# Altium schematic sheet RP2040_MCU.SchDoc: RP2040 CNC
size B; Author: AM; CompanyName: Expatria Technologies; DrawnBy: A.Marles; Engineer: AM; Organization: Expatria Technolgoies; Address1: Schematic; DocumentNumber: 3; SheetNumber: 3; SheetTotal: 4
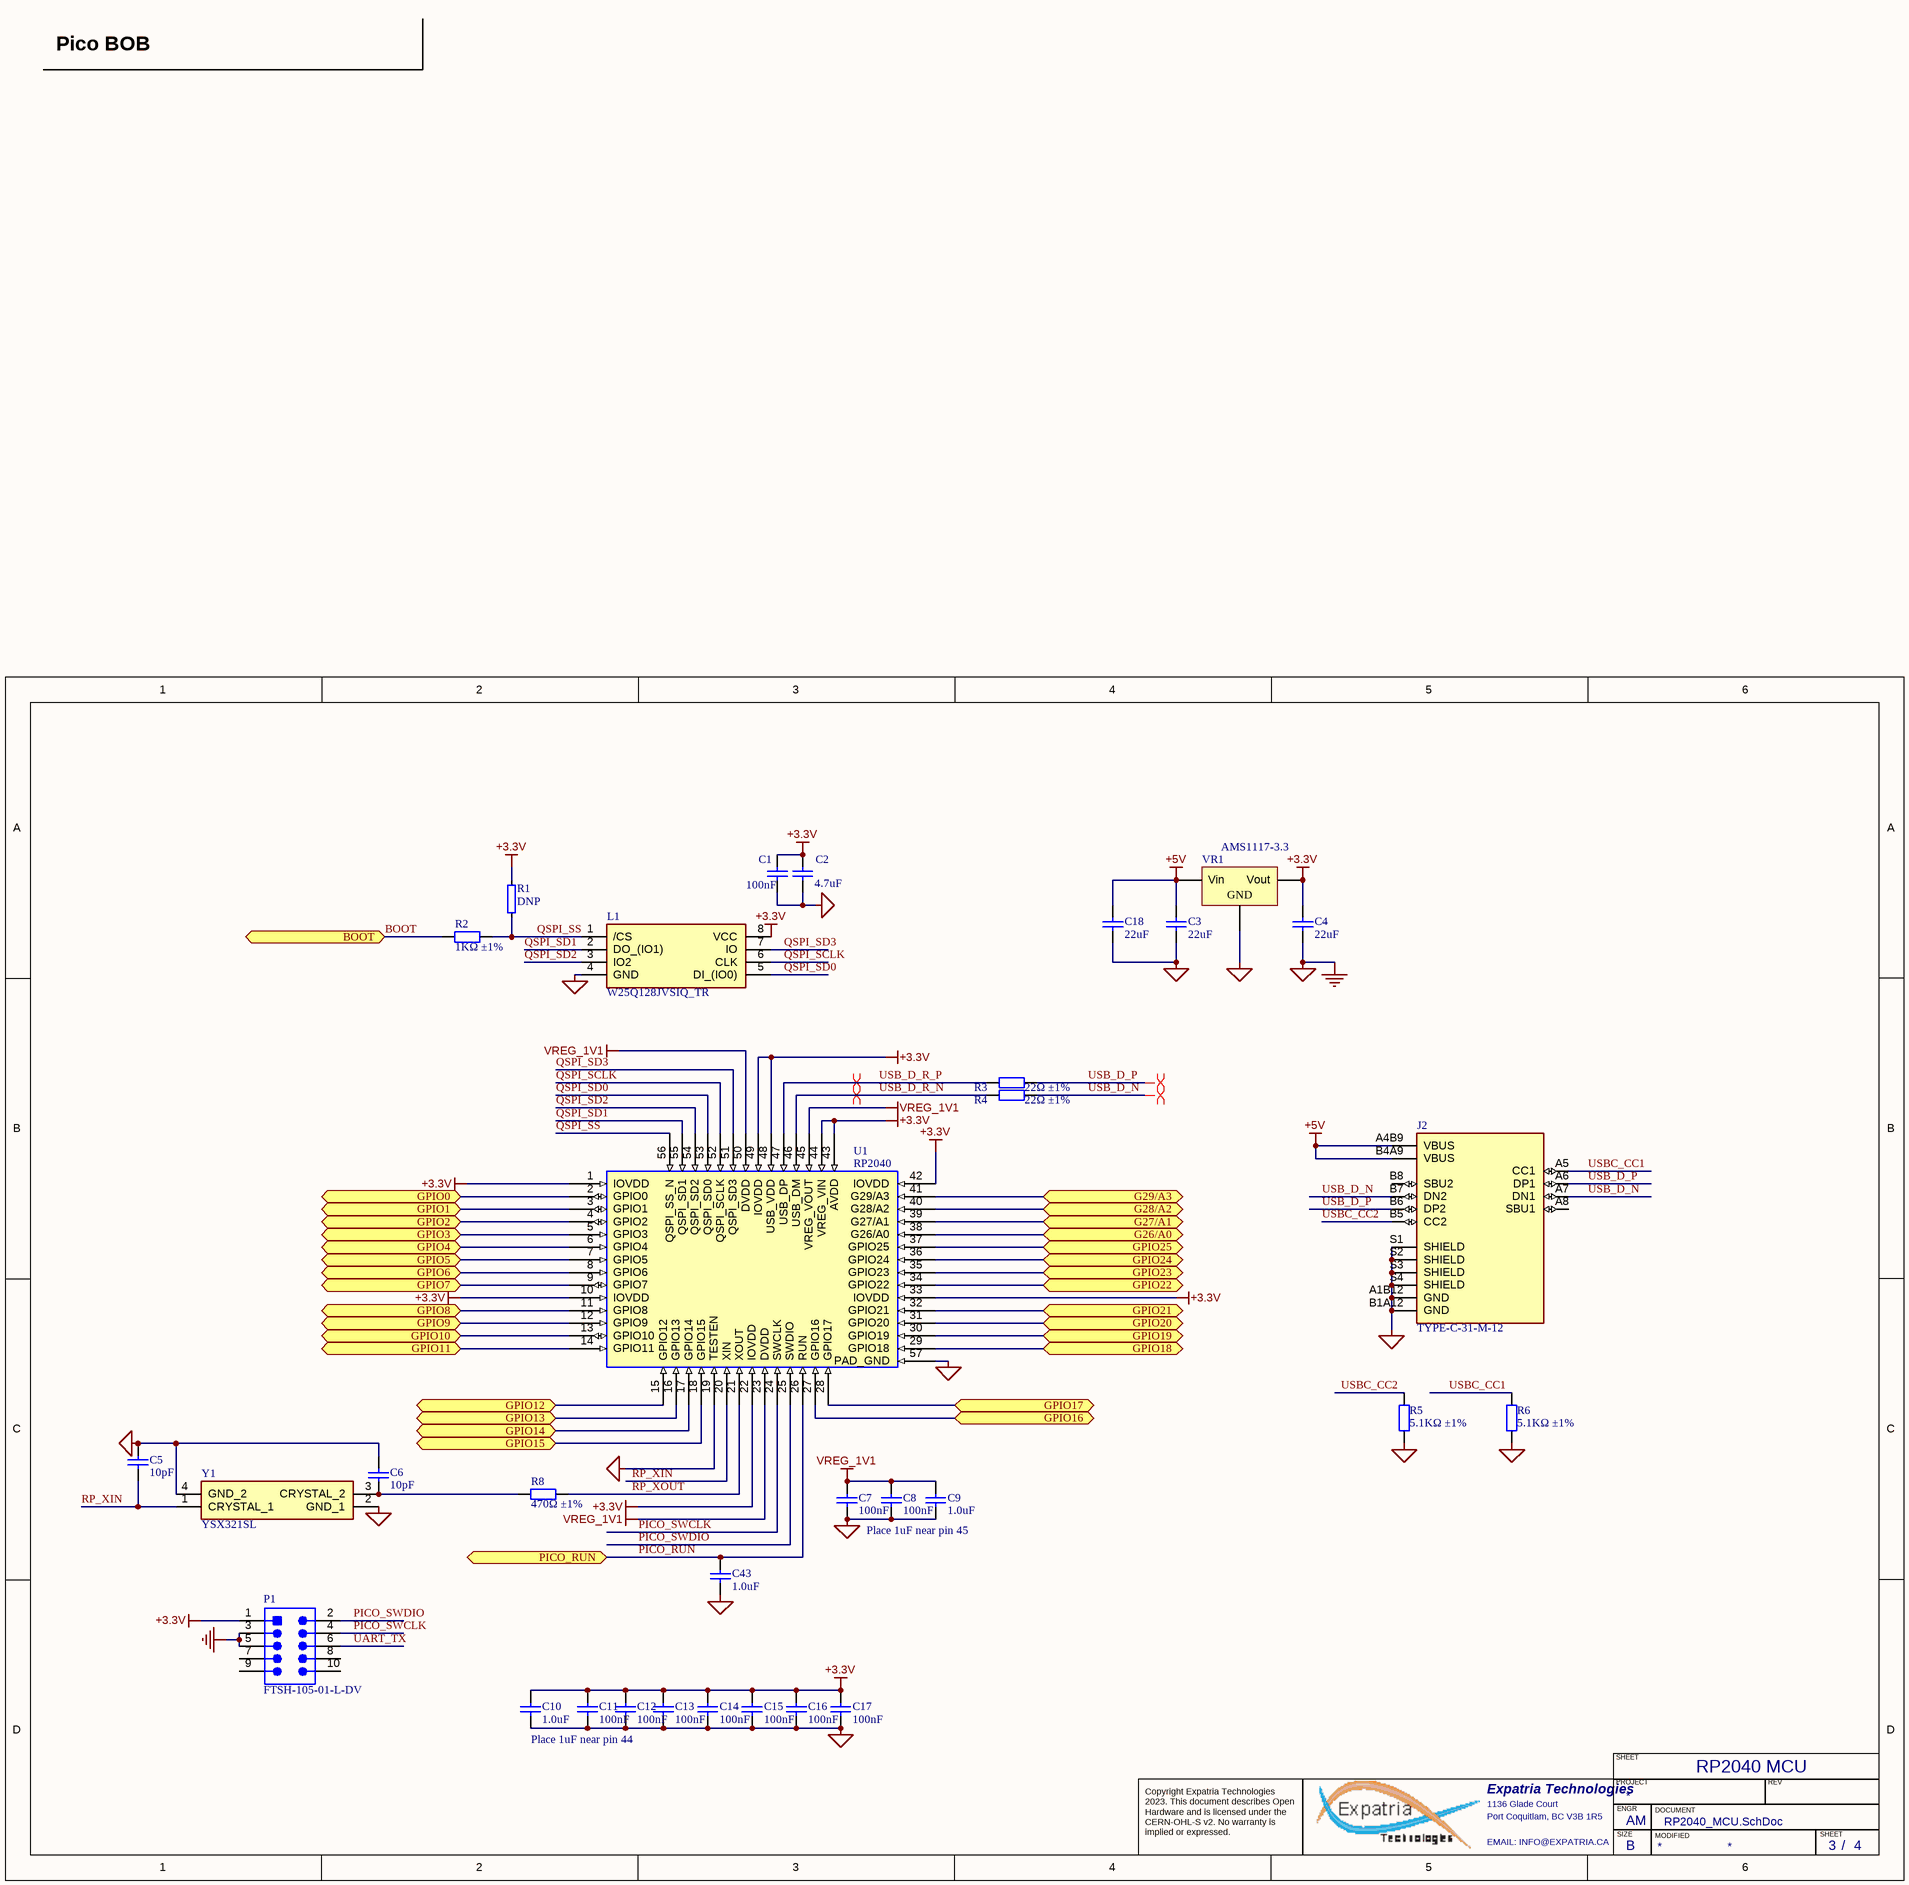
[diagram p0: RP2040_MCU.SchDoc]

## Parts
C1  100nF  [0402_C]
C2  4.7uF  [0402_C]
C3  22uF  [0805_C]
C4  22uF  [0805_C]
C5  10pF  [0402_C]
C6  10pF  [0402_C]
C7  100nF  [0402_C]
C8  100nF  [0402_C]
C9  1.0uF  [0402_C]
C10  1.0uF  [0402_C]
C11  100nF  [0402_C]
C12  100nF  [0402_C]
C13  100nF  [0402_C]
C14  100nF  [0402_C]
C15  100nF  [0402_C]
C16  100nF  [0402_C]
C17  100nF  [0402_C]
C18  22uF  [0805_C]
C43  1.0uF  [0402_C]
J2  TYPE-C-31-M-12  [HRO_TYPE-C-31-M-12]
L1  W25Q128JVSIQ_TR  [SOIC127P780X195-8N]
P1  FTSH-105-01-L-DV  [SMTC-FTSH-105-01-L-DV_V]  (no BOM)
R1  DNP  [0402]
R2  1KΩ ±1%  [0402_R]
R3  22Ω ±1%  [0402_R]
R4  22Ω ±1%  [0402_R]
R5  5.1KΩ ±1%  [0402_R]
R6  5.1KΩ ±1%  [0402_R]
R8  470Ω ±1%  [0402_R]
U1  RP2040  [RP2040]
VR1  AMS1117-3.3  [SOT-223]
Y1  YSX321SL  [YSX321SL]

## Ports
BOOT (bidir), G26/A0 (bidir), G27/A1 (bidir), G28/A2 (bidir), G29/A3 (bidir), GPIO0 (bidir), GPIO1 (bidir), GPIO2 (bidir), GPIO3 (bidir), GPIO4 (bidir), GPIO5 (bidir), GPIO6 (bidir), GPIO7 (bidir), GPIO8 (bidir), GPIO9 (bidir), GPIO10 (bidir), GPIO11 (bidir), GPIO12 (bidir), GPIO13 (bidir), GPIO14 (bidir), GPIO15 (bidir), GPIO16 (bidir), GPIO17 (bidir), GPIO18 (bidir), GPIO19 (bidir), GPIO20 (bidir), GPIO21 (bidir), GPIO22 (bidir), GPIO23 (bidir), GPIO24 (bidir), GPIO25 (bidir), PICO_RUN (bidir)

## Nets
+3.3V: C1.2 C2.2 C4.2 C10.2 C11.2 C12.2 C13.2 C14.2 C15.2 C16.2 C17.2 L1.8(VCC) P1.1 R1.2 U1.1(IOVDD) U1.10(IOVDD) U1.22(IOVDD) U1.33(IOVDD) U1.42(IOVDD) U1.43(AVDD) U1.44(VREG_VIN) U1.48(USB_VDD) U1.49(IOVDD) VR1.2(Vout)
+5V: C3.2 C18.2 J2.A4B9(VBUS) J2.B4A9(VBUS) VR1.3(Vin)
GND: C1.1 C2.1 C3.1 C4.1 C5.2 C6.2 C7.1 C8.1 C9.1 C10.1 C11.1 C12.1 C13.1 C14.1 C15.1 C16.1 C17.1 C18.1 C43.1 J2.A1B12(GND) J2.B1A12(GND) J2.S1(SHIELD) J2.S2(SHIELD) J2.S3(SHIELD) J2.S4(SHIELD) L1.4(GND) P1.3 P1.5 R5.2 R6.2 U1.19(TESTEN) U1.57(PAD_GND) VR1.1(GND) Y1.2(GND_1) Y1.4(GND_2)  [also labelled MCU_GND]
VREG_1V1: C7.2 C8.2 C9.2 U1.23(DVDD) U1.45(VREG_VOUT) U1.50(DVDD)
BOOT: R2.1 ; port BOOT
G26/A0: U1.38(G26/A0) ; port G26/A0
G27/A1: U1.39(G27/A1) ; port G27/A1
G28/A2: U1.40(G28/A2) ; port G28/A2
G29/A3: U1.41(G29/A3) ; port G29/A3
GPIO0: U1.2(GPIO0) ; port GPIO0
GPIO1: U1.3(GPIO1) ; port GPIO1
GPIO2: U1.4(GPIO2) ; port GPIO2
GPIO3: U1.5(GPIO3) ; port GPIO3
GPIO4: U1.6(GPIO4) ; port GPIO4
GPIO5: U1.7(GPIO5) ; port GPIO5
GPIO6: U1.8(GPIO6) ; port GPIO6
GPIO7: U1.9(GPIO7) ; port GPIO7
GPIO8: U1.11(GPIO8) ; port GPIO8
GPIO9: U1.12(GPIO9) ; port GPIO9
GPIO10: U1.13(GPIO10) ; port GPIO10
GPIO11: U1.14(GPIO11) ; port GPIO11
GPIO12: U1.15(GPIO12) ; port GPIO12
GPIO13: U1.16(GPIO13) ; port GPIO13
GPIO14: U1.17(GPIO14) ; port GPIO14
GPIO15: U1.18(GPIO15) ; port GPIO15
GPIO16: U1.27(GPIO16) ; port GPIO16
GPIO17: U1.28(GPIO17) ; port GPIO17
GPIO18: U1.29(GPIO18) ; port GPIO18
GPIO19: U1.30(GPIO19) ; port GPIO19
GPIO20: U1.31(GPIO20) ; port GPIO20
GPIO21: U1.32(GPIO21) ; port GPIO21
GPIO22: U1.34(GPIO22) ; port GPIO22
GPIO23: U1.35(GPIO23) ; port GPIO23
GPIO24: U1.36(GPIO24) ; port GPIO24
GPIO25: U1.37(GPIO25) ; port GPIO25
PICO_RUN: C43.2 U1.26(RUN) ; port PICO_RUN
PICO_SWCLK: P1.4 U1.24(SWCLK)
PICO_SWDIO: P1.2 U1.25(SWDIO)
QSPI_SCLK: L1.6(CLK) U1.52(QSPI_SCLK)
QSPI_SD0: L1.5(DI_(IO0)) U1.53(QSPI_SD0)
QSPI_SD1: L1.2(DO_(IO1)) U1.55(QSPI_SD1)
QSPI_SD2: L1.3(IO2) U1.54(QSPI_SD2)
QSPI_SD3: L1.7(IO) U1.51(QSPI_SD3)
QSPI_SS: L1.1(/CS) R1.1 R2.2 U1.56(QSPI_SS_N)
RP_XIN: C5.1 U1.20(XIN) Y1.1(CRYSTAL_1)
RP_XOUT: R8.2 U1.21(XOUT)
UART_TX: P1.6
USB_D_N: J2.A7(DN1) J2.B7(DN2) R4.1
USB_D_P: J2.A6(DP1) J2.B6(DP2) R3.1
USB_D_R_N: R4.2 U1.46(USB_DM)
USB_D_R_P: R3.2 U1.47(USB_DP)
USBC_CC1: J2.A5(CC1) R6.1
USBC_CC2: J2.B5(CC2) R5.1
NetC6_1: C6.1 R8.1 Y1.3(CRYSTAL_2)

Not connected (* = marked no-connect by the designer): J2 A8(SBU1) B8(SBU2); P1 7 8 9 10

## Layout directives
differential pair: USB_D_N, USB_D_P, USB_D_R_N, USB_D_R_P

## Notes on the sheet
- Pico BOB
- Place 1uF near pin 45
- Place 1uF near pin 44
- RP2040 MCU
- SHEET
- Expatria Technologies
- 1136 Glade Court
- Port Coquitlam, BC V3B 1R5
- PROJECT
- SIZE
- ENGR
- MODIFIED
- DOCUMENT
- REV
- Copyright Expatria Technologies 2023. This document describes Open Hardware and is licensed under the CERN-OHL-S v2. No warranty is implied or expressed.
- EMAIL: INFO@EXPATRIA.CA
- B
- /

## Library data of the parts
C1 C7 C8 C11-C17 = 0402 100nF (104) 10% 16V: Chip capacitors; Manufacturer: Samsung Electro-Mechanics; PartNumber: CL05B104KO5NNNC; Tolerance: 10%; Voltage: 16V; ComponentLink1Description: Supplier link; ComponentLink1URL: http://www.szlcsc.com/product/details_1877.html; Package: 0402; Supplier: LC; SuppliersPartNumber: C1525; Capacitance: 100nF
C2 = 0402 4.7uF (475) 20% 10V: Chip capacitor; Manufacturer: Samsung Electro-Mechanics; PartNumber: CL05A475MP5NRNC; Tolerance: 20%; Voltage: 10V; ComponentLink1Description: Supplier link; ComponentLink1URL: http://www.szlcsc.com/product/details_24469.html; Package: 0402; Supplier: LC; SuppliersPartNumber: C23733; Capacitance: 4.7uF
C3 C4 C18 = 0805 22uF (226) 20% 25V: Chip capacitors; Manufacturer: Samsung Electro-Mechanics; PartNumber: CL21A226MAQNNNE; Tolerance: 20%; Voltage: 25V; Package: 0805; Supplier: LC; SuppliersPartNumber: C2922481; Capacitance: 22uF; ComponentLink1Description: Supplier link; ComponentLink1URL: http://www.szlcsc.com/product/details_46786.html
C5 C6 = 0402 10pF (100) 5% 50V: Chip capacitors; Manufacturer: Samsung Electro-Mechanics; PartNumber: CL05C100JB5NNNC; Tolerance: 5%; Voltage: 50V; ComponentLink1Description: Supplier link; ComponentLink1URL: http://www.szlcsc.com/product/details_33914.html; Package: 0402; Supplier: LC; SuppliersPartNumber: C32949; Capacitance: 10pF
C9 C10 C43 = 0402 1.0uF (105) 10% 25V: Chip capacitor; Manufacturer: Samsung Electro-Mechanics; PartNumber: CL05A105KA5NQNC; Capacitance: 1uF; Tolerance: 10%; Voltage: 25V; ComponentLink1Description: Supplier link; ComponentLink1URL: http://www.szlcsc.com/product/details_53938.html; Package: 0402; Supplier: LC; SuppliersPartNumber: C52923
J2 = TYPE-C-31-M-12: USB Connectors 24 Receptacle 1 8.94*7.3mm RoHS; MF: HRO Electronics Co., Ltd.; Value: *; SnapEDA_Link: https://www.snapeda.com/parts/TYPE-C-31-M-12/HRO%20Electronics%20Co.,%20Ltd./view-part/3228496/?ref=snap; Package: Package; MP: TYPE-C-31-M-12; Price: None; Availability: Unavailable; SuppliersPartNumber: C165948
L1 = W25Q128JVSIQ_TR: Inductor; Manufacturer_Name: Winbond; Manufacturer_Part_Number: W25Q128JVSIQ TR; Datasheet Link: http://www.winbond.com/resource-files/w25q128jv%20spi%20revc%2011162016.pdf; Height: 1.95mm; Mouser Part Number: 454-W25Q128JVSIQTR; Mouser Price/Stock: https://www.mouser.co.uk/ProductDetail/Winbond/W25Q128JVSIQ-TR?qs=qSfuJ%252Bfl%2Fd7vTyLA9kNdGw%3D%3D; Arrow Part Number: W25Q128JVSIQ TR; Arrow Price/Stock: https://www.arrow.com/en/products/w25q128jvsiqtr/winbond-electronics?region=nac; SuppliersPartNumber: C97521
P1 = CMP-2000-05354-1: Male Header, Pitch 1.27 mm, 2 x 5 Position, Height 5.96 mm, -55 to 125 degC, RoHS, Bulk; Manufacturer: Samtec; Connector Type: Header,Unshrouded; Pitch: 0.050"(1.27mm); Mating Products: FLE-105-01-G-DV-TR-ND-CONNSKT1.27MM10POSDUALSMDCLP-105-02-G-D-P-TR-ND-CONNRCPT10POSDUAL.05"SMDSFMC-105-L2-S-D-TR-ND-CONN.05"SURFACE10POSSMTSFMH-105-02-L-D-TR-ND-CONNRECEPT10POS.50"SMTFLE-105-01-G-DV-A-ND-CONNSKT1.27MM10POSDUALSMDCLP-105-02-G-D-BE-ND-CONNRCPT10POSDUAL.05"SMDFLE-105-01-G-DV-A-P-ND-CONNSKT1.27MM10POSDUALSMDSAM1153-05-ND-CONNRCPT10POSDUAL.05"SMDSAM1155-05-ND-CONNRCPT10POSDUAL.05"SMDSAM1154-05-ND-CONNRCPT10POSDUAL.05"SMDSFMH-105-02-L-D-LC-ND-CONNRECEPT10POS.50"SMTSAM1226-05-ND-CONNRCPT.05"10POSDUALSMD; Catalog Drawings: FTSHSeriesFTSHSeriesSMTSide; Other Names: SAM1161-05; EDA / CAD Models: DownloadfromAcceleratedDesigns; Number of Positions Loaded: All; Number of Positions: 10; Featured Product: Board-To-BoardInterconnectSystems; Online Catalog: FTSHSeries; Product Training Modules: Board-to-BoardConnectors; Category: Connectors,Interconnects; Number of Rows: 2; Contact Finish: Gold; Termination: Solder; Mounting Type: SurfaceMount; Series: FTSH; Contact Mating Length: 0.120"(3.05mm); Row Spacing: 0.050"(1.27mm); Datasheet URL: https://datasheet.ciiva.com/30493/0900766b80adfe36-30493006.pdf; Contact Finish Thickness: 10µin(0.25µm); Features: -; Standard Package: 1; Packaging: Bulk; Datasheet Version: Feb-08; Manufacturer URL: http://www.samtec.com/; Fastening Type: -; Family: RectangularConnectors-Headers,MalePins; Contact Type: MalePin; Color: Black
R1 = RES: Resistor, ±5%, 0.05W; Part Number: R0201-0R; Part number IPS: 00000003245; Value: 0R; Note: Chip Res 5%; Artikkelnr Noca: N.A.; Manufacturer: *; Manufacturer Part Number: *; ComponentLink1URL: *; ComponentLink1Description: Datasheet; ComponentLink2URL: *; ComponentLink2Description: Supplier link; HelpURL: *; Footprint Doc: 0201; LatestRevisionDate: 2017-11-09; Pin Count: 2; Publisher: Nordic Semiconductor; Published: 2014-11-13; Supplier 1: *; Supplier Part Number 1: *; Supplier 2: *; Supplier Part Number 2: *
R2 = 0402 1K (1001) 1%: Chip resistor; Manufacturer: Uniroyal Elec; PartNumber: 0402WGF1001TCE; Power: 1/16W; ComponentLink1Description: Supplier link; ComponentLink1URL: http://www.szlcsc.com/product/details_12256.html; Package: 0402; Supplier: LC; SuppliersPartNumber: C11702; Resistance: 1KΩ; Tolerance: 1%
R3 R4 = 0402 22R (22R0) 1%: Chip resistor; Manufacturer: Uniroyal Elec; PartNumber: 0402WGF220JTCE; Power: 1/16W; ComponentLink1Description: Supplier link; ComponentLink1URL: http://www.szlcsc.com/product/details_25835.html; Package: 0402; Supplier: LC; SuppliersPartNumber: C25092; Resistance: 22Ω; Tolerance: 1%
R5 R6 = 0402 5.1K (5101) 1%: Chip resistor; Manufacturer: Uniroyal Elec; PartNumber: 0402WGF5101TCE; Power: 1/16W; Resistance: 51.1KΩ; ComponentLink1Description: Supplier link; ComponentLink1URL: http://www.szlcsc.com/product/details_26648.html; Package: 0402; Supplier: LC; SuppliersPartNumber: C25905; Tolerance: 1%
R8 = 0402 470R (4700) 1%: Chip resistor; Manufacturer: Uniroyal Elec; PartNumber: 0402WGF4700TCE; Power: 1/16W; ComponentLink1Description: Supplier link; ComponentLink1URL: http://www.szlcsc.com/product/details_25860.html; Package: 0402; Supplier: LC; SuppliersPartNumber: C25117; Resistance: 470Ω; Tolerance: 1%
U1 = RP2040: RP2040 First MCU from RPI
VR1 = SOT-223 AMS1117-3.3: Vout=3.3V 1A 72dB@(120Hz) (LDO); Manufacturer 1: AMS; ComponentLink1Description: 供应商链接; ComponentLink1URL: http://www.szlcsc.com/product/details_6652.html; Package: SOT-223; Supplier: LC; SuppliersPartNumber: C6186; Manufacturer Part Number 1: AMS1117-3.3
Y1 = YSX321SL: Crystal or Oscillator; Manufacturer_Name: YXC; Datasheet Link: https://datasheet.lcsc.com/szlcsc/YSX321SL-30MHZ-10PF-8PPM_C70576.pdf; Height: 0.8mm; Manufacturer_Part_Number: YSX321SL; SuppliersPartNumber: C9002